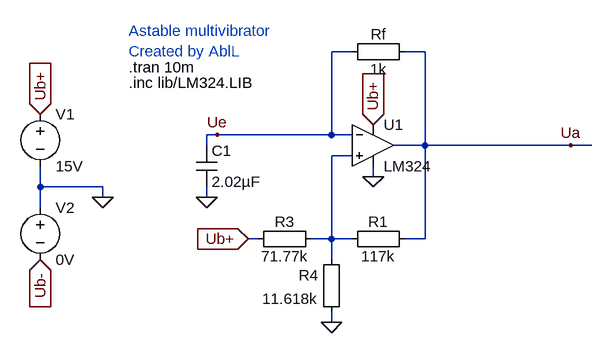
[diagram p0: schematic Astabiler-Multivibrator.asc]
Astabiler-Multivibrator.asc, the LTspice schematic file:
Version 4
SHEET 1 880 680
WIRE 320 -32 288 -32
WIRE 432 -32 400 -32
WIRE 112 96 96 96
WIRE 288 96 288 -32
WIRE 288 96 112 96
WIRE 320 96 288 96
WIRE 96 112 96 96
WIRE 432 112 432 -32
WIRE 432 112 384 112
WIRE 656 112 432 112
WIRE 688 112 656 112
WIRE 320 128 288 128
WIRE 352 160 352 144
WIRE -160 176 -160 144
WIRE -64 176 -160 176
WIRE -64 192 -64 176
WIRE 96 192 96 176
WIRE -160 208 -160 176
WIRE 176 256 160 256
WIRE 288 256 288 128
WIRE 288 256 256 256
WIRE 320 256 288 256
WIRE 432 256 432 112
WIRE 432 256 400 256
WIRE 288 288 288 256
WIRE 288 384 288 368
FLAG 96 192 0
FLAG 352 80 Ub+
IOPIN 352 80 In
FLAG 160 256 Ub+
IOPIN 160 256 In
FLAG -64 192 0
FLAG -160 64 Ub+
IOPIN -160 64 In
FLAG -160 288 Ub-
IOPIN -160 288 In
FLAG 288 384 0
FLAG 352 160 0
FLAG 112 96 Ue
FLAG 656 112 Ua
SYMBOL Opamps\\opamp2 352 48 R0
SYMATTR InstName U1
SYMATTR Value LM324
SYMBOL Misc\\EuropeanResistor 416 -48 R90
WINDOW 0 5 56 VBottom 2
WINDOW 3 27 56 VTop 2
SYMATTR InstName Rf
SYMATTR Value 1k
SYMBOL Misc\\EuropeanResistor 304 272 R270
WINDOW 0 27 56 VTop 2
WINDOW 3 5 56 VBottom 2
SYMATTR InstName R1
SYMATTR Value 117k
SYMBOL Misc\\EuropeanResistor 272 272 M270
WINDOW 0 27 56 VTop 2
WINDOW 3 5 56 VBottom 2
SYMATTR InstName R3
SYMATTR Value 71.77k
SYMBOL Misc\\EuropeanResistor 304 272 M0
SYMATTR InstName R4
SYMATTR Value 11.618k
SYMBOL cap 80 112 R0
SYMATTR InstName C1
SYMATTR Value 2.02µF
SYMBOL voltage -160 48 R0
WINDOW 123 0 0 Left 2
WINDOW 39 0 0 Left 2
SYMATTR InstName V1
SYMATTR Value 15V
SYMBOL voltage -160 192 R0
WINDOW 123 0 0 Left 2
WINDOW 39 0 0 Left 2
SYMATTR InstName V2
SYMATTR Value 0V
TEXT -24 -8 Left 2 !.tran 10m
TEXT -24 16 Left 2 !.inc lib/LM324.LIB
TEXT -24 -64 Left 2 ;Astable multivibrator\nCreated by AblL

The netlist it stands for:
* Astabiler-Multivibrator.asc
XU1 N001 Ue Ub+ 0 Ua LM324  ; pins In+ In- V+ V- OUT
Rf Ua Ue 1k
R1 N001 Ua 117k
R3 N001 Ub+ 71.77k
R4 N001 0 11.618k
C1 Ue 0 2.02µF
V1 Ub+ 0 15V
V2 0 Ub- 0V
.tran 10m
.inc lib/LM324.LIB
* Astable multivibrator
* Created by AblL
.backanno
.end